# EAGLE design lighting_circuit (EAGLE 6.4)
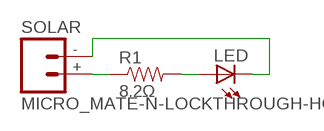
[diagram p0: schematic, sheet 1]

## Parts
LED  LED  [PLCC6]
R1  8.2Ω  RESISTOR1206  [1206]
SOLAR  MICRO_MATE-N-LOCKTHROUGH-HOLE  [2-1445093-2]

## Nets
N$1: LED.1(A) LED.2(A) LED.3(A) R1.2
N$2: R1.1 SOLAR.+
N$3: LED.4(C) LED.5(C) LED.6(C) SOLAR.-

## Library data of the parts
LED = CRC:LED: LEDs Standard schematic elements and footprints for 5mm, 3mm, 1206, and 0603 sized LEDs. 5mm - Spark Fun Electronics SKU : COM-00529 (and others)
R1 = SparkFun-Resistors:RESISTOR: Resistor Basic schematic elements and footprints for 0603, 1206, and PTH resistors.
SOLAR = CRC:MICRO_MATE-N-LOCK

## Board
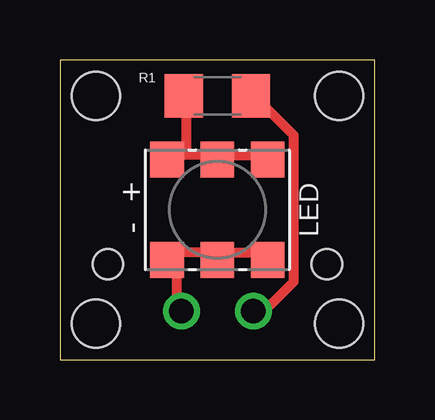
[diagram p1: board, top side]
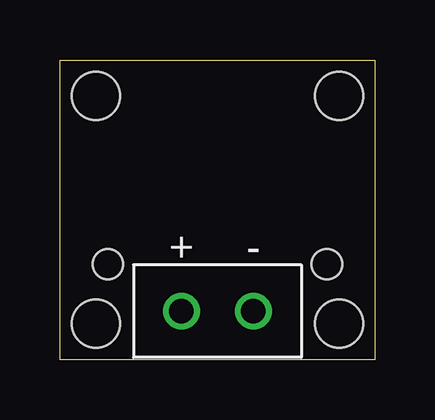
[diagram p2: board, bottom side, seen from below]

Size 13.14 x 12.5 mm. Coordinates in mm from the lower left corner, seen from the top.
Outline: 0,0 13.14,0 13.14,12.5 0,12.5 0,0
Copper layers (1*16): Top 0.0356mm / dielectric 1.5011mm / Bottom 0.0356mm
Design rules "LaenPCBOrder": minimum track width 6mil, minimum drill 13mil, track to track 6mil, track to pad 6mil, pad to pad 6mil, via to via 6mil, smd to smd 6mil, copper to edge 15mil, drill to drill 6mil, minimum pad ring 7mil, minimum via ring 7mil, stop-mask expansion 4mil, vias tented up to drill 0mil, thermal gap 10mil
Holes 2 mm at 1.5,11 1.5,1.5 11.64,11 11.64,1.5

### Footprints (pad centres in the part's own frame; a part is rotated, then mirrored left to right if it is on the bottom)
PLCC6 = smd 1.5 x 1.4: 1 -2.1,2.1; 2 -2.1,0; 3 -2.1,-2.1; 4 2.1,-2.1; 5 2.1,0; 6 2.1,2.1
1206 = smd 1.6 x 1.8: 1 -1.4,0; 2 1.4,0
2-1445093-2 = drill 1.02: + 1.5,0.98; - -1.5,0.98 | hole 1.27: -4.57,-0.98; 4.57,-0.98

### Placement (x,y rotation side)
LED  6.57,6.25 270 top
R1  6.57,11 180 top
SOLAR  6.57,3 180 bottom

### Tracks (layer width: path | path; a pad name or v marks a point on that pad's centre or on a via)
N$1
  Top 0.406: 5.28,8.53 6.5,8.53 LED.2 6.91,8.53 8.53,8.53 LED.1 | 5.28,8.53 4.47,8.53 LED.3 | 5.28,8.53 5.28,10.97 R1.2
N$2
  Top 0.406: R1.1 8.13,10.97 9.75,9.35 9.75,3.25 8.13,1.63 SOLAR.+
N$3
  Top 0.406: LED.6 8.53,4.47 6.91,4.47 LED.5 6.5,4.47 4.47,4.47 LED.4 4.47,4.06 4.88,3.66 4.88,2.03 SOLAR.-